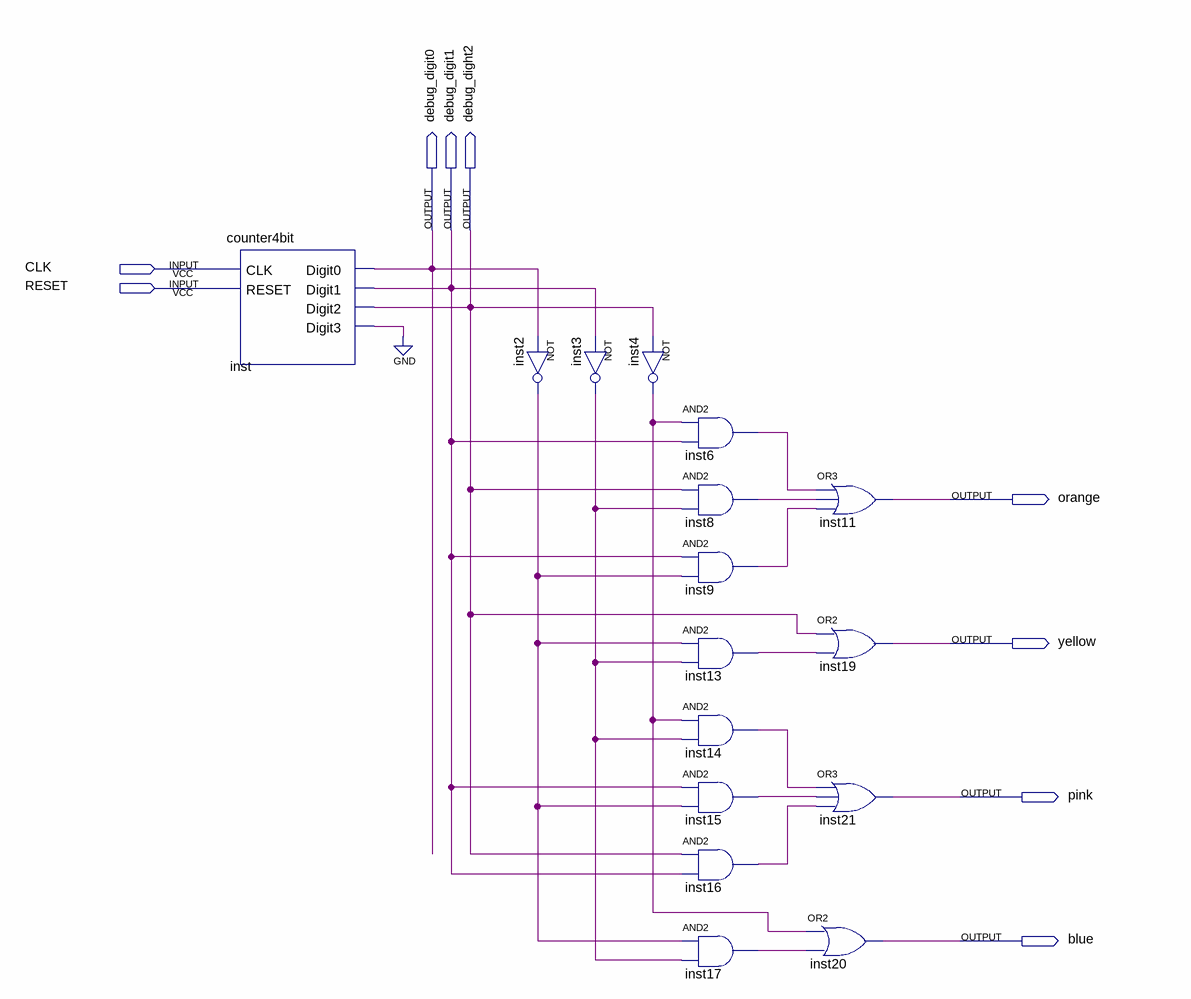
[diagram p0: schematic sheet]
// Quartus schematic stepper_motor_forwards_OLD.bdf as structural Verilog: 16 symbols, 9 pins
module stepper_motor_forwards_OLD (
  input  CLK,
  input  RESET,
  output debug_digit0,
  output debug_digit1,
  output debug_dight2,
  output orange,
  output yellow,
  output pink,
  output blue
);

  wire inst2_out, inst3_out, inst4_out, inst6_out, inst8_out, inst9_out, inst13_out, inst14_out, inst15_out,
       inst16_out, inst17_out, inst_digit3;

  counter4bit inst (
    .CLK(CLK), .RESET(RESET), .Digit0(debug_digit0), .Digit1(debug_digit1), .Digit2(debug_dight2),
    .Digit3(inst_digit3));
  not inst2 (inst2_out, debug_digit0);
  not inst3 (inst3_out, debug_digit1);
  not inst4 (inst4_out, debug_dight2);
  and inst6 (inst6_out, inst4_out, debug_digit1);
  and inst8 (inst8_out, debug_dight2, inst3_out);
  and inst9 (inst9_out, debug_digit1, inst2_out);
  and inst13 (inst13_out, inst2_out, inst3_out);
  and inst14 (inst14_out, inst4_out, inst3_out);
  and inst15 (inst15_out, debug_digit1, inst2_out);
  and inst16 (inst16_out, debug_dight2, debug_digit1);
  and inst17 (inst17_out, inst2_out, inst3_out);
  or inst20 (blue, inst4_out, inst17_out);
  or inst11 (orange, inst6_out, inst8_out, inst9_out);
  or inst19 (yellow, debug_dight2, inst13_out);
  or inst21 (pink, inst14_out, inst15_out, inst16_out);
  // also tied to GND on the sheet: inst_digit3
endmodule
